# EAGLE design SCHEMATIC_board (EAGLE 7.2.0)
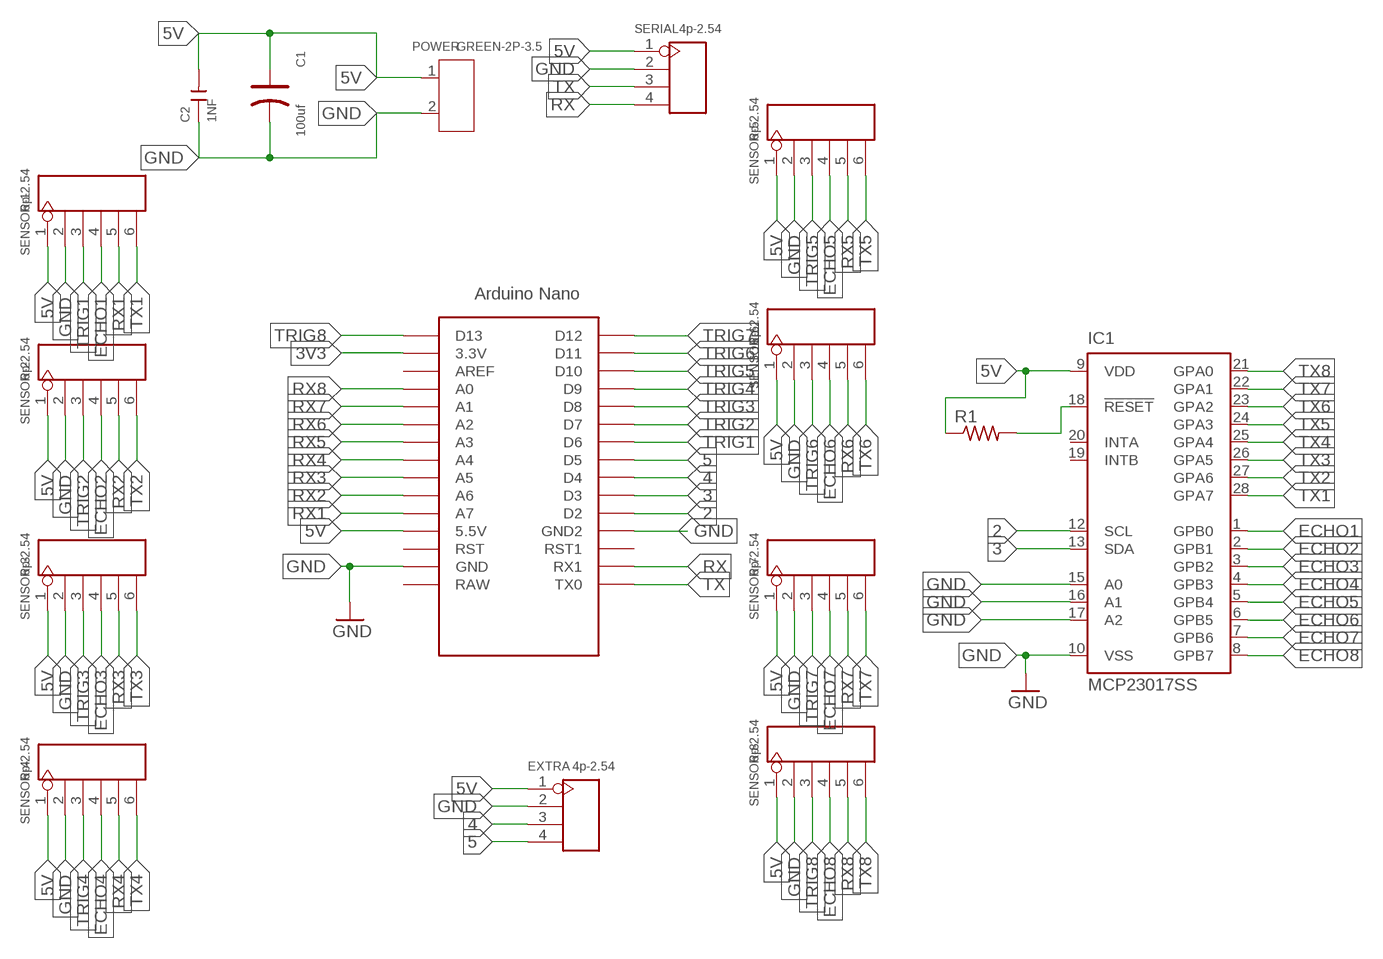
[diagram p0: schematic, sheet 1]

## Parts
C1  100uf  DIP-ALUMINUM-100UF-16V(D5-H7MM)  [PC-D5.3MM]
C2  1NF  CERAMIC-1NF-1KV-10%-X7R(1206)  [C1206]
EXTRA  4p-2.54  DIP-BLACK-MALE-HEADER-VERT(4P-2.54)  [H4-2.54]
IC1  MCP23017SS  [SSOP28]
POWER  GREEN-2P-3.5  SCREW-TERMINAL-GREEN(2P-3.5)  [H2-3.5-7.0X7.0MM]
R1  R-US_M1206  [M1206]
SENSOR-1  6p-2.54  DIP-BLACK-FEMALE-HEADER-VERT(6P-2.54)  [H6-2.54]
SENSOR-2  6p-2.54  DIP-BLACK-FEMALE-HEADER-VERT(6P-2.54)  [H6-2.54]
SENSOR-3  6p-2.54  DIP-BLACK-FEMALE-HEADER-VERT(6P-2.54)  [H6-2.54]
SENSOR-4  6p-2.54  DIP-BLACK-FEMALE-HEADER-VERT(6P-2.54)  [H6-2.54]
SENSOR-5  6p-2.54  DIP-BLACK-FEMALE-HEADER-VERT(6P-2.54)  [H6-2.54]
SENSOR-6  6p-2.54  DIP-BLACK-FEMALE-HEADER-VERT(6P-2.54)  [H6-2.54]
SENSOR-7  6p-2.54  DIP-BLACK-FEMALE-HEADER-VERT(6P-2.54)  [H6-2.54]
SENSOR-8  6p-2.54  DIP-BLACK-FEMALE-HEADER-VERT(6P-2.54)  [H6-2.54]
SERIAL  4p-2.54  DIP-BLACK-MALE-HEADER-VERT(4P-2.54)  [H4-2.54]
U$1  NANO  [NANO]

## Nets
2: IC1.12(SCL) U$1.D2
3: IC1.13(SDA) U$1.D3
3V3: U$1.3.3V
4: EXTRA.3 U$1.D4
5: EXTRA.4 U$1.D5
5V: C1.+ C2.2 EXTRA.1 IC1.9(VDD) POWER.1 R1.1 SENSOR-1.1 SENSOR-2.1 SENSOR-3.1 SENSOR-4.1 SENSOR-5.1 SENSOR-6.1 SENSOR-7.1 SENSOR-8.1 SERIAL.1 U$1.5V(5.5V)
ECHO1: IC1.1(GPB0) SENSOR-1.4
ECHO2: IC1.2(GPB1) SENSOR-2.4
ECHO3: IC1.3(GPB2) SENSOR-3.4
ECHO4: IC1.4(GPB3) SENSOR-4.4
ECHO5: IC1.5(GPB4) SENSOR-5.4
ECHO6: IC1.6(GPB5) SENSOR-6.4
ECHO7: IC1.7(GPB6) SENSOR-7.4
ECHO8: IC1.8(GPB7) SENSOR-8.4
GND: C1.- C2.1 EXTRA.2 IC1.10(VSS) IC1.15(A0) IC1.16(A1) IC1.17(A2) POWER.2 SENSOR-1.2 SENSOR-2.2 SENSOR-3.2 SENSOR-4.2 SENSOR-5.2 SENSOR-6.2 SENSOR-7.2 SENSOR-8.2 SERIAL.2 U$1.GND U$1.GND1(GND2)
N$5: IC1.18(!RESET) R1.2
RX: SERIAL.4 U$1.RX1
RX1: SENSOR-1.5 U$1.A7
RX2: SENSOR-2.5 U$1.A6
RX3: SENSOR-3.5 U$1.A5
RX4: SENSOR-4.5 U$1.A4
RX5: SENSOR-5.5 U$1.A3
RX6: SENSOR-6.5 U$1.A2
RX7: SENSOR-7.5 U$1.A1
RX8: SENSOR-8.5 U$1.A0
TRIG1: SENSOR-1.3 U$1.D6
TRIG2: SENSOR-2.3 U$1.D7
TRIG3: SENSOR-3.3 U$1.D8
TRIG4: SENSOR-4.3 U$1.D9
TRIG5: SENSOR-5.3 U$1.D10
TRIG6: SENSOR-6.3 U$1.D11
TRIG7: SENSOR-7.3 U$1.D12
TRIG8: SENSOR-8.3 U$1.D13
TX: SERIAL.3 U$1.TX0
TX1: IC1.28(GPA7) SENSOR-1.6
TX2: IC1.27(GPA6) SENSOR-2.6
TX3: IC1.26(GPA5) SENSOR-3.6
TX4: IC1.25(GPA4) SENSOR-4.6
TX5: IC1.24(GPA3) SENSOR-5.6
TX6: IC1.23(GPA2) SENSOR-6.6
TX7: IC1.22(GPA1) SENSOR-7.6
TX8: IC1.21(GPA0) SENSOR-8.6
Unconnected: IC1.19(INTB) IC1.20(INTA) U$1.AREF U$1.ICSP1 U$1.ICSP2 U$1.ICSP3 U$1.ICSP4 U$1.ICSP5 U$1.ICSP6 U$1.RAW U$1.RST U$1.RST1

## Library data of the parts
C1 = Seeed-Capacitor-2016:DIP-ALUMINUM-100UF-16V(D5-H7MM): 302030031; MPN: KS 100uF/16V
C2 = Seeed-Capacitor-2016:CERAMIC-1NF-1KV-10%-X7R?(1206): 302010189; MPN: CC1206KKX7RCBB102
EXTRA SERIAL = Seeed-Connector -2016:DIP-BLACK-MALE-HEADER-VERT(4P-2.54): 320020017; MPN: P125-1104A0BS116A1
IC1 = adafruit:MCP23017: http://ww1.microchip.com/downloads/en/DeviceDoc/21952a.pdf Source: http://ww1.microchip.com/downloads/en/DeviceDoc/21952a.pdf
POWER = Seeed-Connector -2016:SCREW-TERMINAL-GREEN(2P-3.5): 320110028
R1 = adafruit:R-US_: RESISTOR, American symbol
SENSOR-1-SENSOR-8 = Seeed-Connector -2016:DIP-BLACK-FEMALE-HEADER-VERT(6P-2.54): 320030060; MPN: F185-1106A1BSYC1
U$1 = Arduino-clone:NANO: Arduino Nano

## Board
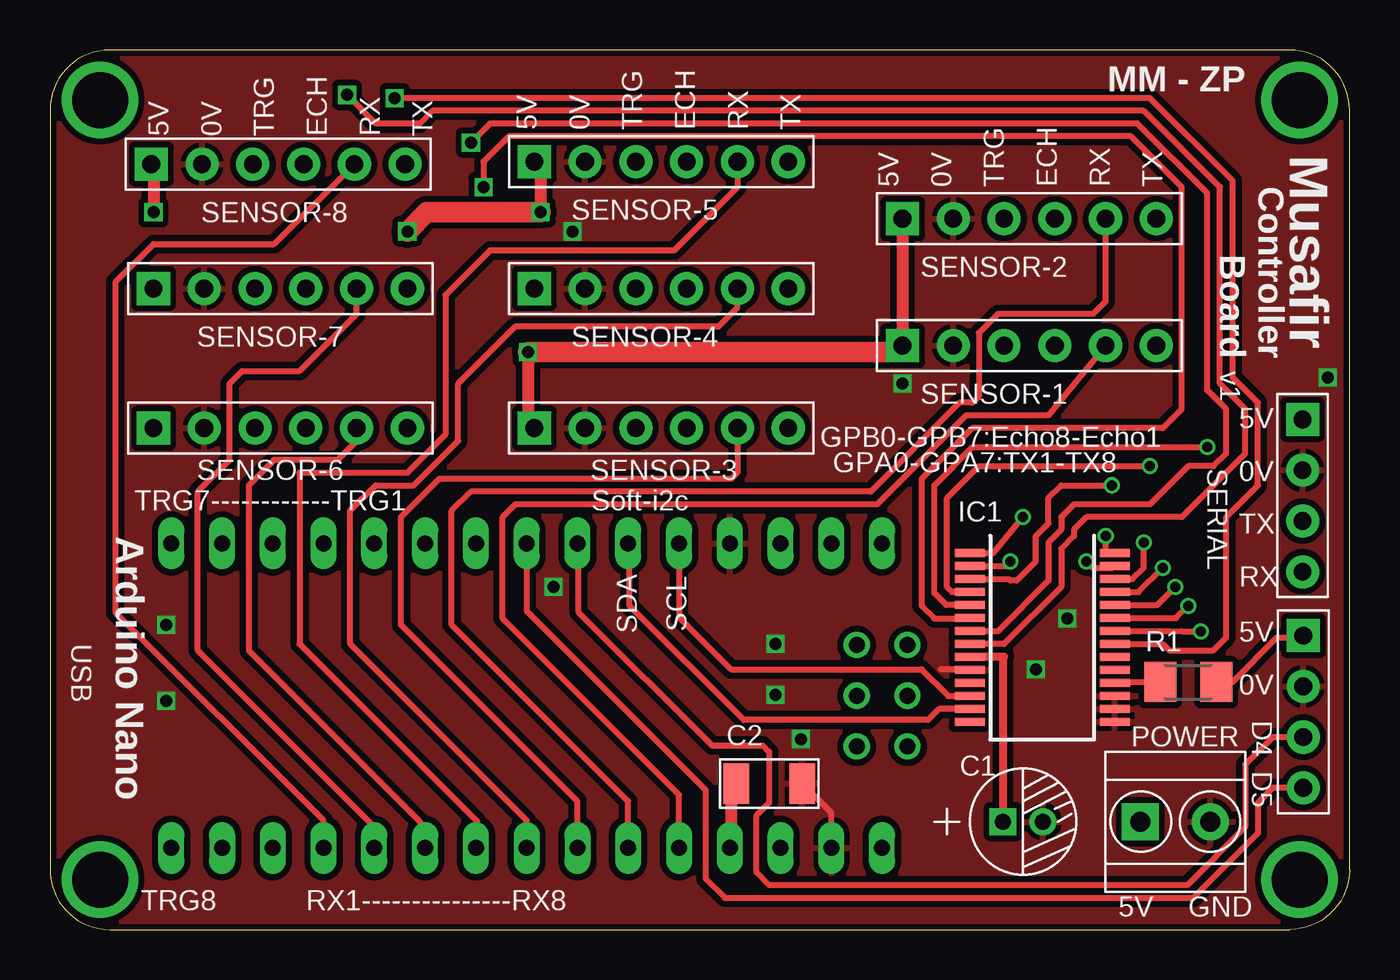
[diagram p1: board, top side]
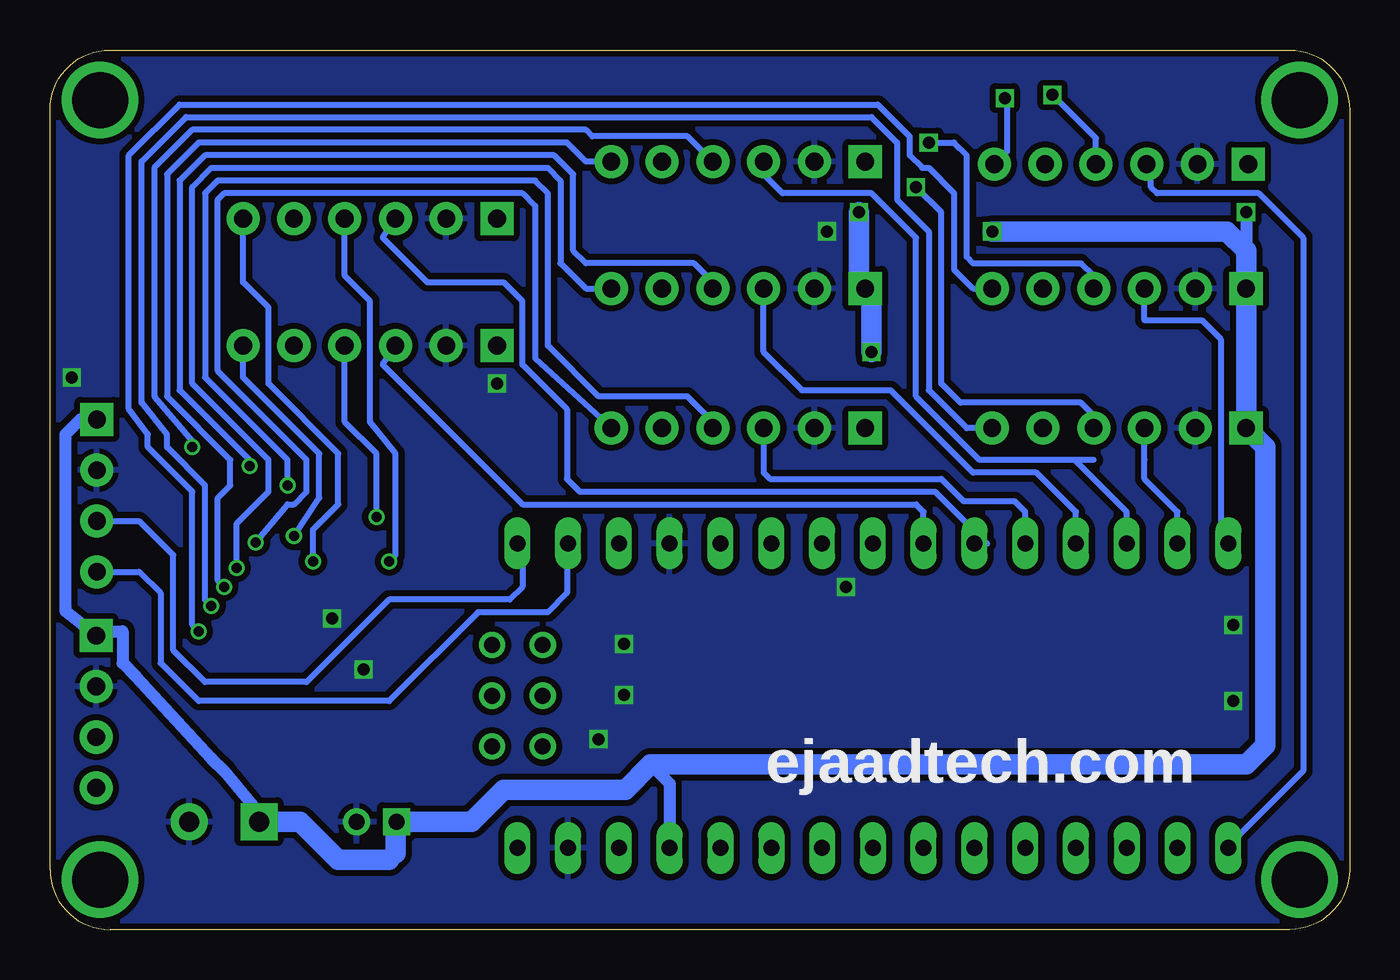
[diagram p2: board, bottom side, seen from below]

Size 65 x 44 mm. Coordinates in mm from the lower left corner, seen from the top.
Outline: 3,0 62,0 arc90 65,3 65,41 arc90 62,44 3,44 arc90 0,41 0,3 arc90 3,0
Copper layers (1*16): Top 0.035mm / dielectric 1.5mm / Bottom 0.035mm
Design rules "SeeedStudio_2layer_DRU_no_angle_20140221": minimum track width 6mil, minimum drill 12mil, track to track 6mil, track to pad 6mil, pad to pad 6mil, via to via 6mil, smd to smd 0mil, copper to edge 10mil, drill to drill 10mil, minimum pad ring 10mil, minimum via ring 6mil, stop-mask expansion 2mil, vias tented up to drill 100mil, thermal gap 10mil

### Footprints (pad centres in the part's own frame; a part is rotated, then mirrored left to right if it is on the bottom)
PC-D5.3MM = drill 0.8 pad 1.35 square: + -1,0 | drill 0.8 pad 1.35: - 1,0
C1206 = smd 1.27 x 2.032: 1 -1.651,0; 2 1.651,0
H4-2.54 = drill 0.889 pad 1.651 square: 1 0,3.81 | drill 0.889 pad 1.651: 2 0,1.27; 3 0,-1.27; 4 0,-3.81
SSOP28 = smd 0.4 x 1.5: 1 -4.225,-3.625; 2 -3.575,-3.625; 3 -2.925,-3.625; 4 -2.275,-3.625; 5 -1.625,-3.625; 6 -0.975,-3.625; 7 -0.325,-3.625; 8 0.325,-3.625; 9 0.975,-3.625; 10 1.625,-3.625; 11 2.275,-3.625; 12 2.925,-3.625; 13 3.575,-3.625; 14 4.225,-3.625; 15 4.225,3.625; 16 3.575,3.625; 17 2.925,3.625; 18 2.275,3.625; 19 1.625,3.625; 20 0.975,3.625; 21 0.325,3.625; 22 -0.325,3.625; 23 -0.975,3.625; 24 -1.625,3.625; 25 -2.275,3.625; 26 -2.925,3.625; 27 -3.575,3.625; 28 -4.225,3.625
H2-3.5-7.0X7.0MM = drill 1 pad 1.85 square: 1 -1.75,0 | drill 1 pad 1.85: 2 1.75,0
M1206 = smd 1.6 x 2: 1 -1.4,0; 2 1.4,0
H6-2.54 = drill 0.889 pad 1.651 square: 1 0,6.35 | drill 0.889 pad 1.651: 2 0,3.81; 3 0,1.27; 4 0,-1.27; 5 0,-3.81; 6 0,-6.35
NANO = drill 0.8 long: 3.3V -10.16,24.13; 5V -10.16,-1.27; A0 -10.16,19.05; A1 -10.16,16.51; A2 -10.16,13.97; A3 -10.16,11.43; A4 -10.16,8.89; A5 -10.16,6.35; A6 -10.16,3.81; A7 -10.16,1.27; AREF -10.16,21.59; D2 5.08,1.27; D3 5.08,3.81; D4 5.08,6.35; D5 5.08,8.89; D6 5.08,11.43; D7 5.08,13.97; D8 5.08,16.51; D9 5.08,19.05; D10 5.08,21.59; D11 5.08,24.13; D12 5.08,26.67; D13 -10.16,26.67; GND -10.16,-6.35; GND1 5.08,-1.27; RAW -10.16,-8.89; RST -10.16,-3.81; RST1 5.08,-3.81; RX1 5.08,-6.35; TX0 5.08,-8.89 | drill 0.8: ICSP1 -5.08,-10.16; ICSP2 -5.08,-7.62; ICSP3 -2.54,-10.16; ICSP4 -2.54,-7.62; ICSP5 0,-10.16; ICSP6 0,-7.62

### Placement (x,y rotation side)
C1  48.67,5.4 0 top
C2  35.97,7.3 180 top
EXTRA  62.69,10.89 0 top
IC1  49.62,14.61 270 top
POWER  56.29,5.4 0 top
R1  56.93,12.38 180 top
SENSOR-1  48.99,29.21 90 top
SENSOR-2  48.99,35.56 90 top
SENSOR-3  30.57,25.08 90 top
SENSOR-4  30.57,32.07 90 top
SENSOR-5  30.57,38.42 90 top
SENSOR-6  11.53,25.08 90 top
SENSOR-7  11.53,32.07 90 top
SENSOR-8  11.41,38.29 90 top
SERIAL  62.65,21.71 0 top
U$1  32.73,14.24 90 top

### Tracks (layer width: path | path; a pad name or v marks a point on that pad's centre or on a via)
2
  Top 0.305: U$1.D2 31.46,15.62 34.07,13.02 43.59,13.02 44.93,11.68 IC1.12
3
  Top 0.305: IC1.13 44.46,11.03 43.91,10.48 34.7,10.48 28.99,16.19 28.99,19.25 U$1.D3
4
  Top 0.305: U$1.D4 26.45,19.25 26.45,15.88 33.11,9.21 35.66,9.21 35.97,8.89 35.97,6.35 35.34,5.71 35.34,2.86 35.97,2.22 56.88,2.22 59.78,5.13 59.78,8.26 61.16,9.62 EXTRA.3
5
  Top 0.305: U$1.D5 23.84,15.94 32.8,6.99 32.8,2.54 33.75,1.59 57.2,1.59 60.42,4.81 60.42,6.35 61.16,7.08 EXTRA.4
5V  (via drill 0.6)
  Top 0.305: U$1.5V 34,6.98 C2.2 | IC1.9 46.02,13.65 | 47.72,6.99 47.67,5.99 C1.+ | R1.1 59.15,12.38 61.37,14.61 62.59,14.61 EXTRA.1
  Top 0.406: 46.02,13.65 47.72,13.65 47.67,13.61 C1.+
  Top 0.61: SENSOR-8.1 5.17,38.18 v5.17,35.88 | SENSOR-5.1 24.54,38.42 v24.54,35.88 | v23.91,28.89 23.91,25.08 SENSOR-3.1 | SENSOR-2.1 SENSOR-1.1 | C2.2 34.07,7.05 34.07,4.13
  Top 1.016: SENSOR-1.1 42.64,28.89 v23.91,28.89 | v17.88,34.92 18.83,35.88 v24.54,35.88
  Bottom 0.61: 48.04,3.49 47.72,3.81 | 47.72,5.35 C1.+ | POWER.1 54.7,5.56 54.7,6.03 56.29,7.94 56.93,8.57 60.74,12.7 61.37,13.34 61.37,14.92 62.59,14.92 EXTRA.1 64.23,15.93 64.23,24.77 63.48,25.52 SERIAL.1 | 34,4.76 U$1.5V 34,7.3 34.95,8.26 | v5.17,35.88 5.17,33.97 | 24.54,32.07 SENSOR-4.1 23.91,31.75
  Bottom 1.016: POWER.1 52.48,5.4 50.58,3.49 48.04,3.49 | 47.72,3.81 47.72,5.35 | C1.+ 43.91,5.4 42.32,6.99 36.23,6.99 34.95,8.26 5.17,8.26 4.22,9.21 4.22,24.13 SENSOR-6.1 SENSOR-7.1 5.17,33.97 6.13,34.92 v17.88,34.92 | v24.54,35.88 24.54,32.07 | 23.91,31.75 v23.91,28.89
ECHO1  (via drill 0.5)
  Top 0.305: IC1.1 47.18,18.83 v48.67,20.64
  Bottom 0.305: v48.67,20.64 48.67,23.81 50.26,25.4 SENSOR-1.4
ECHO2  (via drill 0.5)
  Top 0.305: IC1.2 47.95,18.18 48.04,18.26 v48.04,18.41
  Bottom 0.305: v48.04,18.41 47.72,18.73 47.72,23.81 48.99,25.4 48.99,31.43 50.26,32.7 SENSOR-2.4
ECHO3  (via drill 0.5)
  Top 0.305: IC1.3 47.97,17.53 48.04,17.46 48.35,17.46 49.31,18.41 49.31,19.68 49.94,20.32 49.94,21.59 50.58,22.23 v53.12,22.23
  Bottom 0.305: v53.12,22.23 53.12,23.5 57.24,27.62 57.24,36.83 56.61,37.47 40.73,37.47 40.1,36.83 40.1,29.21 37.56,26.67 33.11,26.67 31.84,25.4 SENSOR-3.4
ECHO4  (via drill 0.5)
  Top 0.305: IC1.4 45.13,16.88 44.86,17.14 44.86,21.59 46.45,23.18 v55.02,23.18
  Bottom 0.305: v55.02,23.18 55.02,23.5 58.52,26.99 58.52,37.47 57.24,38.73 39.78,38.73 38.83,37.78 38.83,33.97 38.2,33.34 32.8,33.34 31.84,32.38 SENSOR-4.4
ECHO5  (via drill 0.5)
  Top 0.305: IC1.5 44.83,16.23 44.23,16.83 44.23,22.23 46.13,24.13 v57.88,24.13
  Bottom 0.305: v57.88,24.13 57.88,24.45 59.78,26.67 59.78,38.1 57.88,40.01 38.2,40.01 37.88,39.69 33.11,39.69 SENSOR-5.4
ECHO6  (via drill 0.6)
  Top 0.305: IC1.6 45.98,15.56 44.23,15.56 43.59,16.19 43.59,22.54 46.13,25.08 55.66,25.08 56.61,26.04 56.61,37.15 54.07,39.69 22.95,39.69 21.68,38.42 v21.68,37.15
  Bottom 0.305: SENSOR-6.4 12.79,25.72 13.43,26.35 19.46,26.35 20.41,27.3 20.41,35.88 v21.68,37.15
ECHO7  (via drill 0.6)
  Top 0.305: IC1.7 47.4,14.92 49.94,17.46 49.94,19.37 50.58,20 50.58,20.64 51.21,21.27 55.02,21.27 56.93,23.18 58.2,23.18 58.83,23.81 58.83,26.04 57.88,26.99 57.88,36.83 54.39,40.32 22,40.32 v21.05,39.37
  Bottom 0.305: SENSOR-7.4 12.79,32.7 13.43,33.34 18.83,33.34 19.14,33.66 19.14,38.73 19.78,39.37 v21.05,39.37
ECHO8  (via drill 0.6)
  Top 0.305: IC1.8 47.72,14.29 50.58,17.14 50.58,19.05 51.21,19.68 51.21,20 51.85,20.64 56.61,20.64 59.78,23.81 59.78,26.04 58.52,27.3 58.52,37.15 54.7,40.96 19.14,40.96 18.51,40.32 16.29,40.32 v14.86,41.75
  Bottom 0.305: SENSOR-8.4 12.69,39.58 v14.86,41.75
GND  (via drill 0.6)
  Top 0.305: U$1.GND 39.08,5.84 C2.1 | IC1.10 45.96,13.02 44.55,13.02
  other vias: 36.29,14.29 37.56,9.53 26.13,34.92 49.31,13.02 50.9,15.56 63.91,27.62 42.64,27.3 5.81,15.24 5.81,11.43 36.29,11.75 25.18,17.14
  pour Top (isolate 0.305): 0.09,44.13 65.18,44.13 65.18,0 0.09,0
  pour Bottom (isolate 0.305): -0.86,44.45 65.82,44.45 65.82,42.55 65.5,42.55 65.5,-0.32 -0.86,-0.32 -0.86,3.81
N$1  (via drill 2.8)
  other vias: 2.5,2.5
N$2  (via drill 2.8)
  other vias: 62.5,2.5
N$3  (via drill 2.8)
  other vias: 62.5,41.5
N$4  (via drill 2.8)
  other vias: 2.5,41.5
N$5
  Top 0.305: IC1.18 53.3,12.38 R1.2
RX
  Bottom 0.305: U$1.RX1 39.15,19.25 39.15,16.83 40.1,15.88 43.59,15.88 48.04,11.43 57.56,11.43 59.47,13.34 59.47,16.83 60.54,17.9 SERIAL.4
RX1
  Top 0.305: U$1.A7 31.46,6.73 22.64,15.56 22.64,20.64 23.27,21.27 41.37,21.27 45.81,25.72 49.94,25.72 SENSOR-1.5
RX2
  Top 0.305: U$1.A6 28.92,6.42 20.1,15.24 20.1,20.95 21.05,21.91 41.05,21.91 45.5,26.35 46.13,26.35 46.45,26.67 46.45,29.84 47.4,30.8 52.16,30.8 52.8,31.43 SENSOR-2.5
RX3
  Top 0.305: U$1.A5 26.38,6.42 17.56,15.24 17.56,20.64 19.46,22.54 34.07,22.54 34.38,22.86 SENSOR-3.5
RX4
  Top 0.305: U$1.A4 23.84,5.46 15.02,14.29 15.02,20.95 16.29,22.23 18.19,22.23 20.41,24.45 20.41,27.3 23.27,30.16 33.43,30.16 34.38,31.11 SENSOR-4.5
RX5
  Top 0.305: SENSOR-5.5 34.38,37.15 31.21,33.97 22,33.97 19.78,31.75 19.78,24.77 17.88,22.86 12.48,22.86 12.48,14.29 20.73,6.03 21.37,5.41 U$1.A3
RX6
  Top 0.305: SENSOR-6.5 15.34,24.45 14.38,23.5 11.21,23.5 9.94,22.23 9.94,13.97 18.51,5.4 18.51,4.14 U$1.A2
RX7
  Top 0.305: U$1.A1 16.22,5.14 7.4,13.97 7.4,21.91 8.98,23.5 8.98,27.3 9.62,27.94 12.48,27.94 15.34,30.8 SENSOR-7.5
RX8
  Top 0.305: SENSOR-8.5 11.22,34.29 5.17,34.29 3.27,32.38 3.27,15.88 13.68,5.46 U$1.A0
TRIG1
  Bottom 0.305: SENSOR-1.3 48.35,28.26 41.37,21.27 21.68,21.27 21.3,20.89 U$1.D6
TRIG2
  Bottom 0.305: SENSOR-2.3 48.35,34.61 46.13,32.38 42.32,32.38 41.37,31.43 41.37,28.26 39.15,26.04 39.15,22.54 38.51,21.91 20.73,21.91 18.13,19.3 U$1.D7
TRIG3
  Bottom 0.305: U$1.D8 16.22,20.89 16.76,21.43 19.3,21.43 20.41,22.54 28.99,22.54 29.3,22.86 SENSOR-3.3
TRIG4
  Bottom 0.305: SENSOR-4.3 29.3,28.89 27.4,26.99 22.95,26.99 18.83,22.86 15.65,22.86 13.68,20.89 U$1.D9
TRIG5
  Bottom 0.305: 12.79,23.5 13.75,23.5 | 13.75,23.5 18.51,23.5 21.68,26.67 21.68,34.61 23.91,36.83 28.35,36.83 29.3,37.78 SENSOR-5.3 | U$1.D10 11.14,20.89 13.75,23.5
TRIG6
  Bottom 0.305: U$1.D11 8.6,20.89 10.26,22.54 SENSOR-6.3 10.26,23.5
TRIG7
  Bottom 0.305: U$1.D12 6.45,19.32 6.45,29.53 7.4,30.48 10.26,30.48 SENSOR-7.3
TRIG8
  Bottom 0.305: SENSOR-8.3 9.94,38.18 9.94,37.15 9.62,36.83 4.54,36.83 2.32,34.61 2.32,7.94 6.06,4.19 U$1.D13
TX
  Bottom 0.305: U$1.TX0 41.67,19.37 41.69,19.37 41.37,19.05 41.37,17.14 42.01,16.51 48.04,16.51 52.16,12.38 57.24,12.38 58.83,13.97 58.83,18.73 60.54,20.44 SERIAL.3
TX1  (via drill 0.5)
  Top 0.305: IC1.28 52.8,18.83 v52.8,19.68
  Bottom 0.305: SENSOR-1.6 55.34,27.62 51.53,23.81 51.53,21.59 v52.8,19.68
TX2  (via drill 0.5)
  Top 0.305: v51.85,18.41 52.16,18.1 53.17,18.1 IC1.27 52.85,18.1
  Bottom 0.305: v51.85,18.41 51.85,20 50.58,21.27 50.58,23.81 54.07,27.3 54.07,31.11 55.34,32.38 SENSOR-2.6
TX3  (via drill 0.5)
  Top 0.305: IC1.26 54.14,17.53 54.7,18.1 v54.7,19.37
  Bottom 0.305: v54.7,19.37 53.12,21.27 52.8,21.27 52.16,21.91 52.16,23.5 56.61,27.94 56.61,36.51 56.29,36.83 41.37,36.83 40.73,36.2 40.73,28.57 SENSOR-3.6
TX4  (via drill 0.5)
  Top 0.305: IC1.25 54.44,16.88 v55.66,18.1
  Bottom 0.305: v55.66,18.1 55.66,20.32 54.07,21.91 54.07,23.5 57.88,27.3 57.88,37.15 56.93,38.1 40.1,38.1 39.47,37.47 39.47,33.34 38.2,32.07 SENSOR-4.6
TX5  (via drill 0.5)
  Top 0.305: IC1.24 55.38,16.23 v56.29,17.14
  Bottom 0.305: v56.29,17.14 56.61,17.46 56.61,21.59 55.98,22.23 55.98,23.5 59.15,26.67 59.15,37.78 57.56,39.37 39.15,39.37 38.2,38.42 SENSOR-5.6
TX6  (via drill 0.5)
  Top 0.305: IC1.23 56.31,15.58 v56.93,16.19
  Bottom 0.305: v56.93,16.19 57.24,16.51 57.24,22.23 59.15,24.13 59.15,24.77 60.42,26.35 60.42,38.42 58.2,40.64 23.91,40.64 22.64,39.37 22.64,36.51 21.05,34.92 21.05,26.99 19.14,25.08 SENSOR-6.6
TX7  (via drill 0.5)
  Top 0.305: IC1.22 55.97,14.93 56.61,14.92 v57.56,14.92
  Bottom 0.305: v57.56,14.92 57.88,15.24 57.88,21.91 60.1,24.13 60.1,24.77 61.05,26.04 61.05,38.73 58.52,41.27 23.59,41.27 22,39.69 22,38.73 21.37,38.1 21.05,38.1 19.78,36.83 19.78,33.02 18.83,32.07 SENSOR-7.6
TX8  (via drill 0.6)
  Top 0.305: IC1.21 55.66,14.29 55.98,13.97 58.2,13.97 58.83,14.61 58.83,20.64 60.42,22.23 60.42,26.35 59.15,27.62 59.15,37.47 55.02,41.59 v17.24,41.59
  Bottom 0.305: 17.77,38.31 SENSOR-8.6 17.13,38.93 17.13,41.48 v17.24,41.59

### Text on the board
tNames: MM - ZP | 5V / 0V / TRG / ECH / RX / TX | 5V / 0V / TRG / ECH / RX / TX | Musafir | 5V / 0V / TRG / ECH / RX / TX | Controller / Board | v1 | GPB0-GPB7:Echo8-Echo1 | GPA0-GPA7:TX1-TX8 | TRG7------------TRG1 | Soft-i2c | Arduino Nano | SDA | 5V / 0V / TX / RX | SCL | USB | 5V / 0V | D4 | D5 | TRG8 | RX1---------------RX8 | 5V | GND
bNames: ejaadtech.com